# Altium schematic sheet Buck.SchDoc
size A4; SheetNumber: 2; SheetTotal: 4
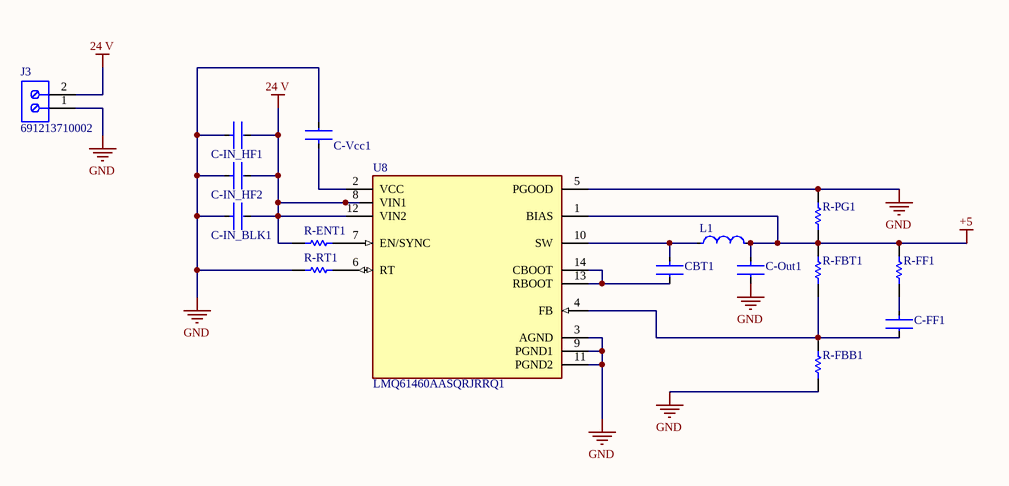
[diagram p0: Buck.SchDoc]

## Parts
C-FF1  GRM188R60J106ME47D  [FP-GRM188-0_1-e0_2_0_55-IPC_A]  (value not drawn)
C-IN_BLK1  GRM188R60J106ME47D  [FP-GRM188-0_1-e0_2_0_55-IPC_A]  (value not drawn)
C-IN_HF1  GRM188R60J106ME47D  [FP-GRM188-0_1-e0_2_0_55-IPC_A]  (value not drawn)
C-IN_HF2  GRM188R60J106ME47D  [FP-GRM188-0_1-e0_2_0_55-IPC_A]  (value not drawn)
C-Out1  GRM188R60J106ME47D  [FP-GRM188-0_1-e0_2_0_55-IPC_A]  (value not drawn)
C-Vcc1  GRM188R60J106ME47D  [FP-GRM188-0_1-e0_2_0_55-IPC_A]  (value not drawn)
CBT1  GRM188R60J106ME47D  [FP-GRM188-0_1-e0_2_0_55-IPC_A]  (value not drawn)
J3  691213710002  [691213710002]
L1  (no value)  [FP-B82422A-MFG]
R-ENT1  (no value)  [RESC1609X50X30NL8T20]
R-FBB1  (no value)  [RESC1609X50X30NL8T20]
R-FBT1  (no value)  [RESC1609X50X30NL8T20]
R-FF1  (no value)  [RESC1609X50X30NL8T20]
R-PG1  (no value)  [RESC1609X50X30NL8T20]
R-RT1  (no value)  [RESC1609X50X30NL8T20]
U8  LMQ61460AASQRJRRQ1  [FP-RJR0014A-MFG]

## Nets
24 V: C-IN_BLK1.2 C-IN_HF1.2 C-IN_HF2.2 J3.2 R-ENT1.1 U8.8(VIN1) U8.12(VIN2)
+5: C-Out1.1 L1.2 R-FBT1.2 R-FF1.2 R-PG1.1 U8.1(BIAS)
GND: C-IN_BLK1.1 C-IN_HF1.1 C-IN_HF2.1 C-Out1.2 C-Vcc1.2 J3.1 R-FBB1.1 R-PG1.2 R-RT1.1 U8.3(AGND) U8.5(PGOOD) U8.9(PGND1) U8.11(PGND2)
NetC-FF1_1: C-FF1.1 R-FF1.1
NetC-FF1_2: C-FF1.2 R-FBB1.2 R-FBT1.1 U8.4(FB)
NetC-Vcc1_1: C-Vcc1.1 U8.2(VCC)
NetCBT1_1: CBT1.1 L1.1 U8.10(SW)
NetCBT1_2: CBT1.2 U8.13(RBOOT) U8.14(CBOOT)
NetR-ENT1_2: R-ENT1.2 U8.7(EN/SYNC)
NetR-RT1_2: R-RT1.2 U8.6(RT)

## Library data of the parts
C-FF1 C-IN_BLK1 C-IN_HF1 C-IN_HF2 C-Out1 C-Vcc1 CBT1 = CMP-2006-02792-2: Chip Multilayer Ceramic Capacitors for General Purpose, 0603, 10uF, X5R, 15%, 20%, 6.3V; Packaging: Tape and Reel; Voltage Rating (DC): 6.3V; Width: 0.031inch; Termination: SMD/SMT; Dielectric: X5R; Package Quantity: 4000; Voltage Rating: 6.3V; Capacitance: 10uF; Case/Package: 0603; Min Operating Temperature: -55°C; Voltage: 6.3V; Length: 1.6mm; Thickness: 0.035inch; Lead Free: Lead Free; Depth: 0.8mm; Case Code (Imperial): 0603; Max Operating Temperature: 85°C; Material: Ceramic; Height: 0.8mm; Tolerance: 20%; Mount: Surface Mount; REACH SVHC: No SVHC; Radiation Hardening: No; Case Code (Metric): 1608
J3 = CMP-1502-02526-2: NexarPartId: 8917718; Number of Contacts: 2; Current Rating: 10A; Stripping Length: -7mm; Wire Gauge (Max): 26AWG; Plating: Brass, Steel; Wire Gauge (Min): 16AWG; Voltage: 300V; Number of Levels: 1; Pitch: 5.0038mm; Color: Green; Number of Pins: 2; Housing Material: Nylon; Termination: Screw; Max Operating Temperature: 105°C; Min Operating Temperature: -40°C; Packaging: Box; Current: 10A; REACH SVHC: Unknown; Width: 10.6mm; RoHS: Compliant; Mount: Through Hole; Height: 10mm; Contact Material: Brass; Length: 8.3mm; Lead Pitch: 5mm; Wire/Cable Gauge: 26AWG; Voltage Rating: 300V; Number of Positions Per Level: 2; Contact Plating: Tin
L1 = CMP-2000-05912-2: FIXED IND 10UH 180MA 1.6 OHM SMD; Tolerance: 10%; Core Material: Ferrite; Q Factor: 27; Self Resonant Frequency: 25MHz; Shielding: Unshielded; Test Frequency: 1MHz; Series Resistance: 1.6R; Radiation Hardening: No; REACH SVHC: No SVHC; Width: 0.098inch; RoHS Compliant: Yes; Case/Package: 1210; DC Current: 180mA; Package Quantity: 2000; Height - Seated (Max): 0.083inch; Rated Current-Max: 180mA; Series: SIMID; Mount: Surface Mount; Depth: 2.8mm; Resistor Type: Wirewound; Max DC Current: 180mA; Termination: SMD/SMT; Contact Plating: Tin; Height: 2.1mm; Inductance: 10uH; Case Code (Metric): 3225; Lead Free: Lead Free; Weight: 0.001764oz; Max Operating Temperature: 125°C; Length: 3.5mm; Packaging: Tape and Reel; Case Code (Imperial): 1210; Inductance Tolerance: 10%; Ratings: AEC-Q200; Number of Pins: 2; Current Rating: 180mA; Military Standard: Not; DC Resistance (DCR): 1.6R
R-ENT1 R-FBB1 R-FBT1 R-FF1 R-PG1 R-RT1 = CMP-2000-03816-5: Chip Resistor, 0 Ohm, Jumper, 100 mW, -55 to 155 degC, 0603 (1608 Metric), RoHS, Tape and Reel; Manufacturer: Vishay Semiconductor; Voltage Rating: 75 V; Package Quantity: 5000; DatasheetVersion: 06/2012; Min Operating Temperature: -55 degC; ComponentLink1URL: http://www.vishay.com/; Mounting Technology: Surface Mount; Height: 0.45 mm; ComponentLink1Description: Manufacturer URL; REACH SVHC: Unknown; PackageReference: 0603; Packaging: Tape and Reel; Max Operating Temperature: 155 degC; Mount: Surface Mount; ComponentLink2Description: Datasheet; PackageDescription: 2-Pin Surface Mount Device, Body 1.575 x 0.85 mm; Length: 1.55 mm; ComponentLink2URL: http://www.vishay.com/docs/20035/dcrcwe3.pdf; Pins: 2; RoHSCompliant: true
U8 = CMP-04918-000596-1: AUTOMOTIVE 3-V TO 36-V, 6-A LOW